# EAGLE schematic Schrittmotor (EAGLE 7.6.0)
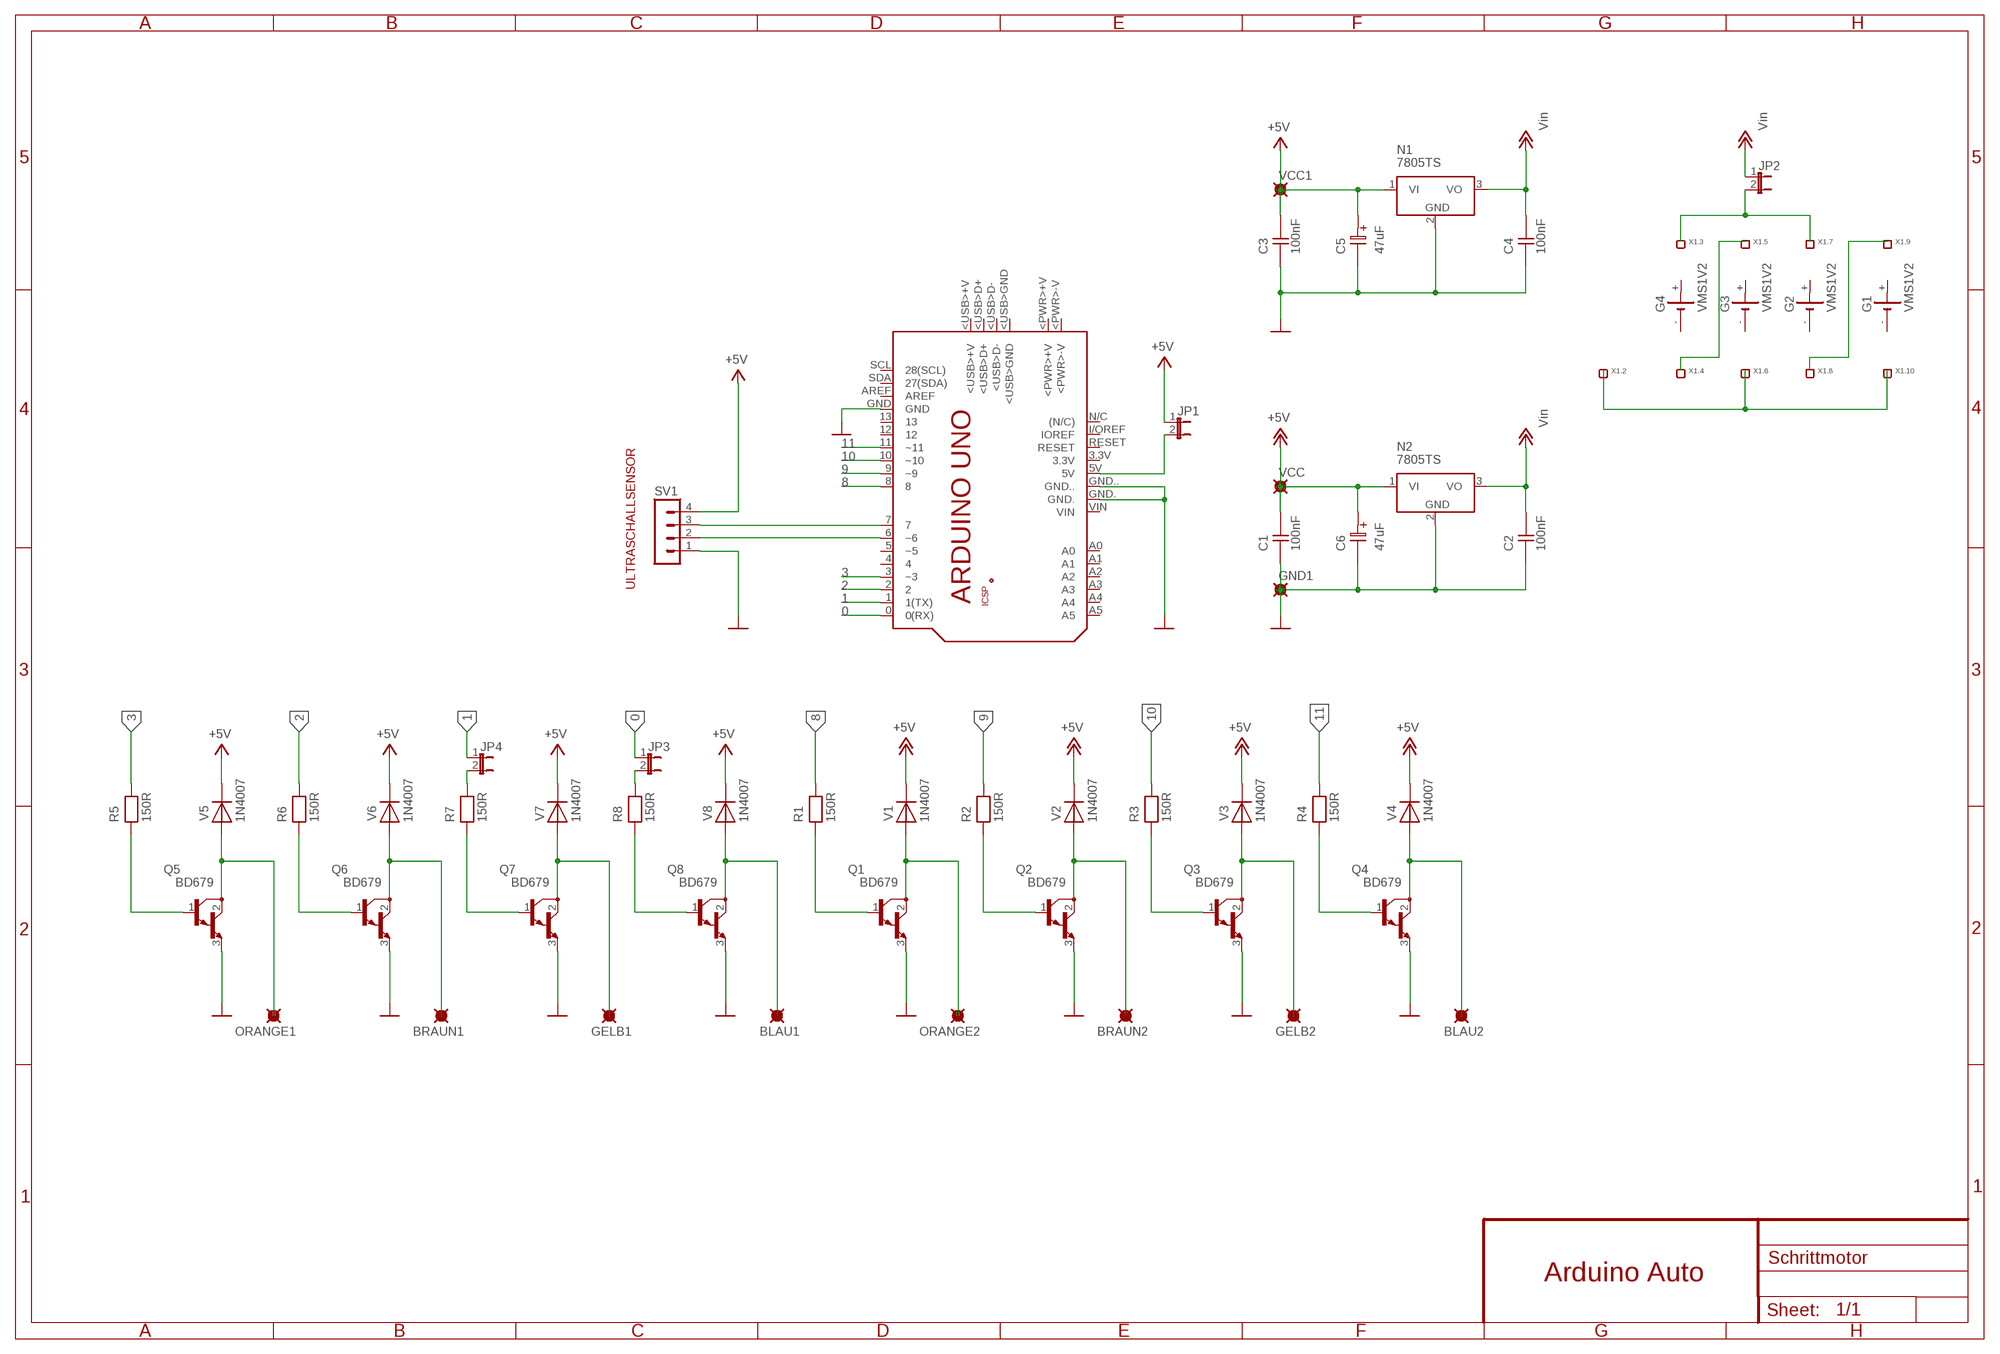
[diagram p0: schematic, sheet 1]

## Parts
BLAU1  K-STIFT  [PAD-01]
BLAU2  K-STIFT  [PAD-01]
BRAUN1  K-STIFT  [PAD-01]
BRAUN2  K-STIFT  [PAD-01]
C1  100nF  C-7.5  [C-7,5]
C2  100nF  C-7.5  [C-7,5]
C3  100nF  C-7.5  [C-7,5]
C4  100nF  C-7.5  [C-7,5]
C5  47uF  ELC-5S  [ES-5S]
C6  47uF  ELC-5S  [ES-5S]
G1  VMS1V2  [VMS1V2]
G2  VMS1V2  [VMS1V2]
G3  VMS1V2  [VMS1V2]
G4  VMS1V2  [VMS1V2]
GELB1  K-STIFT  [PAD-01]
GELB2  K-STIFT  [PAD-01]
GND1  K-STIFT  [PAD-01]
JP1  JP1E  [JP1]
JP2  JP1E  [JP1]
JP3  JP1E  [JP1]
JP4  JP1E  [JP1]
N1  7805TS  [TO-220S]
N2  7805TS  [TO-220S]
ORANGE1  K-STIFT  [PAD-01]
ORANGE2  K-STIFT  [PAD-01]
PCB1  ARDUINO_UNO  [ARDUINO_UNO]
Q1  BD679  BD649  [TO220]
Q2  BD679  BD649  [TO220]
Q3  BD679  BD649  [TO220]
Q4  BD679  BD649  [TO220]
Q5  BD679  BD649  [TO220]
Q6  BD679  BD649  [TO220]
Q7  BD679  BD649  [TO220]
Q8  BD679  BD649  [TO220]
R1  150R  R-10  [R-10]
R2  150R  R-10  [R-10]
R3  150R  R-10  [R-10]
R4  150R  R-10  [R-10]
R5  150R  R-10  [R-10]
R6  150R  R-10  [R-10]
R7  150R  R-10  [R-10]
R8  150R  R-10  [R-10]
SV1  MA04-1  [MA04-1]
V1  1N4007  D-7.5  [D-7,5]
V2  1N4007  D-7.5  [D-7,5]
V3  1N4007  D-7.5  [D-7,5]
V4  1N4007  D-7.5  [D-7,5]
V5  1N4007  D-7.5  [D-7,5]
V6  1N4007  D-7.5  [D-7,5]
V7  1N4007  D-7.5  [D-7,5]
V8  1N4007  D-7.5  [D-7,5]
VCC  K-STIFT  [PAD-01]
VCC1  K-STIFT  [PAD-01]
X1  LH-10  [LH-10]

## Nets
0: JP3.1 PCB1.0(0(RX))
1: JP4.1 PCB1.1(1(TX))
2: PCB1.2 R6.2
3: PCB1.3(~3) R5.2
8: PCB1.8 R1.2
9: PCB1.9(~9) R2.2
10: PCB1.10(~10) R3.2
11: PCB1.11(~11) R4.2
+5V: C3.2 C5.1 JP1.1 N1.1(VI) SV1.4 V5.2(K) V6.2(K) V7.2(K) V8.2(K) VCC1.1(K-STIFT)
+9V: C2.2 C4.2 JP2.1 N1.3(VO) N2.3(VO) ; supply symbol labelled Vin
-5V: C1.2 C6.1 N2.1(VI) V1.2(K) V2.2(K) V3.2(K) V4.2(K) VCC.1(K-STIFT) ; supply symbol labelled +5V
GND: C1.1 C2.1 C3.1 C4.1 C5.2 C6.2 GND1.1(K-STIFT) N1.2(GND) N2.2(GND) PCB1.GND PCB1.GND. PCB1.GND.. Q1.3(E) Q2.3(E) Q3.3(E) Q4.3(E) Q5.3(E) Q6.3(E) Q7.3(E) Q8.3(E) SV1.1
N$1: Q1.1(B) R1.1
N$2: ORANGE2.1(K-STIFT) Q1.2(C) V1.1(A)
N$3: X1.2 X1.6 X1.10
N$4: Q2.1(B) R2.1
N$5: BRAUN2.1(K-STIFT) Q2.2(C) V2.1(A)
N$6: JP2.2 X1.3 X1.7
N$7: Q3.1(B) R3.1
N$8: GELB2.1(K-STIFT) Q3.2(C) V3.1(A)
N$9: PCB1.7 SV1.3
N$10: Q4.1(B) R4.1
N$11: BLAU2.1(K-STIFT) Q4.2(C) V4.1(A)
N$12: PCB1.6(~6) SV1.2
N$13: Q5.1(B) R5.1
N$14: ORANGE1.1(K-STIFT) Q5.2(C) V5.1(A)
N$15: JP1.2 PCB1.5V
N$16: Q6.1(B) R6.1
N$17: BRAUN1.1(K-STIFT) Q6.2(C) V6.1(A)
N$18: X1.4 X1.5
N$19: Q7.1(B) R7.1
N$20: GELB1.1(K-STIFT) Q7.2(C) V7.1(A)
N$21: X1.8 X1.9
N$22: Q8.1(B) R8.1
N$23: BLAU1.1(K-STIFT) Q8.2(C) V8.1(A)
N$24: JP4.2 R7.2
N$25: JP3.2 R8.2
Unconnected: G1.+ G1.- G2.+ G2.- G3.+ G3.- G4.+ G4.- PCB1.3.3V PCB1.4 PCB1.5(~5) PCB1.12 PCB1.13 PCB1.+5V PCB1.<PWR>+V PCB1.<PWR>-V PCB1.<USB>+V PCB1.<USB>D+ PCB1.<USB>D- PCB1.<USB>GND PCB1.A0 PCB1.A1 PCB1.A2 PCB1.A3 PCB1.A4 PCB1.A5 PCB1.AREF PCB1.GND_ PCB1.I/OREF(IOREF) PCB1.MISO PCB1.MOSI PCB1.N/C((N/C)) PCB1.RESET PCB1.RESET. PCB1.SCK PCB1.SCL(28(SCL)) PCB1.SDA(27(SDA)) PCB1.VIN X1.1

## Notes on the sheet
- ULTRASCHALLSENSOR
- Arduino Auto

## Library data of the parts
BLAU1 BLAU2 BRAUN1 BRAUN2 GELB1 GELB2 GND1 ORANGE1 ORANGE2 VCC VCC1 = connect:K-STIFT: KONTAKTSTIFT
C1-C4 = rcl:C: CAPACITOR
C5 C6 = rcl:ELC: ELEKTROLYTIC CAPACITOR
G1-G4 = battery:VMS1V2: NC ACCU Varta Mempac S 1V2 - 2V4
JP1-JP4 = jumper:JP1E: JUMPER
N1 N2 = linear:78*: Positive VOLTAGE REGULATOR
PCB1 = Arduino:ARDUINO_UNO: Device for representing an Arduino Uno board with a footprint in an EAGLE design. Created by Dave Young for Element14. More EAGLE documentation at: http://www.element14.com/community/community/knode/cadsoft_eagle
Q1-Q8 = transistor-npn:BD649*: NPN Darlington Transistor
R1-R8 = rcl:R: RESISTOR
SV1 = con-lstb:MA04-1: PIN HEADER; OC_FARNELL: unknown; OC_NEWARK: unknown
V1-V8 = halbleiter:D: DIODE
X1 = connect:LH-10: CONNECTOR 10-pin pcb board low profile headers